# EAGLE design VarmoLed - Rev A1 (EAGLE 7.5.0)
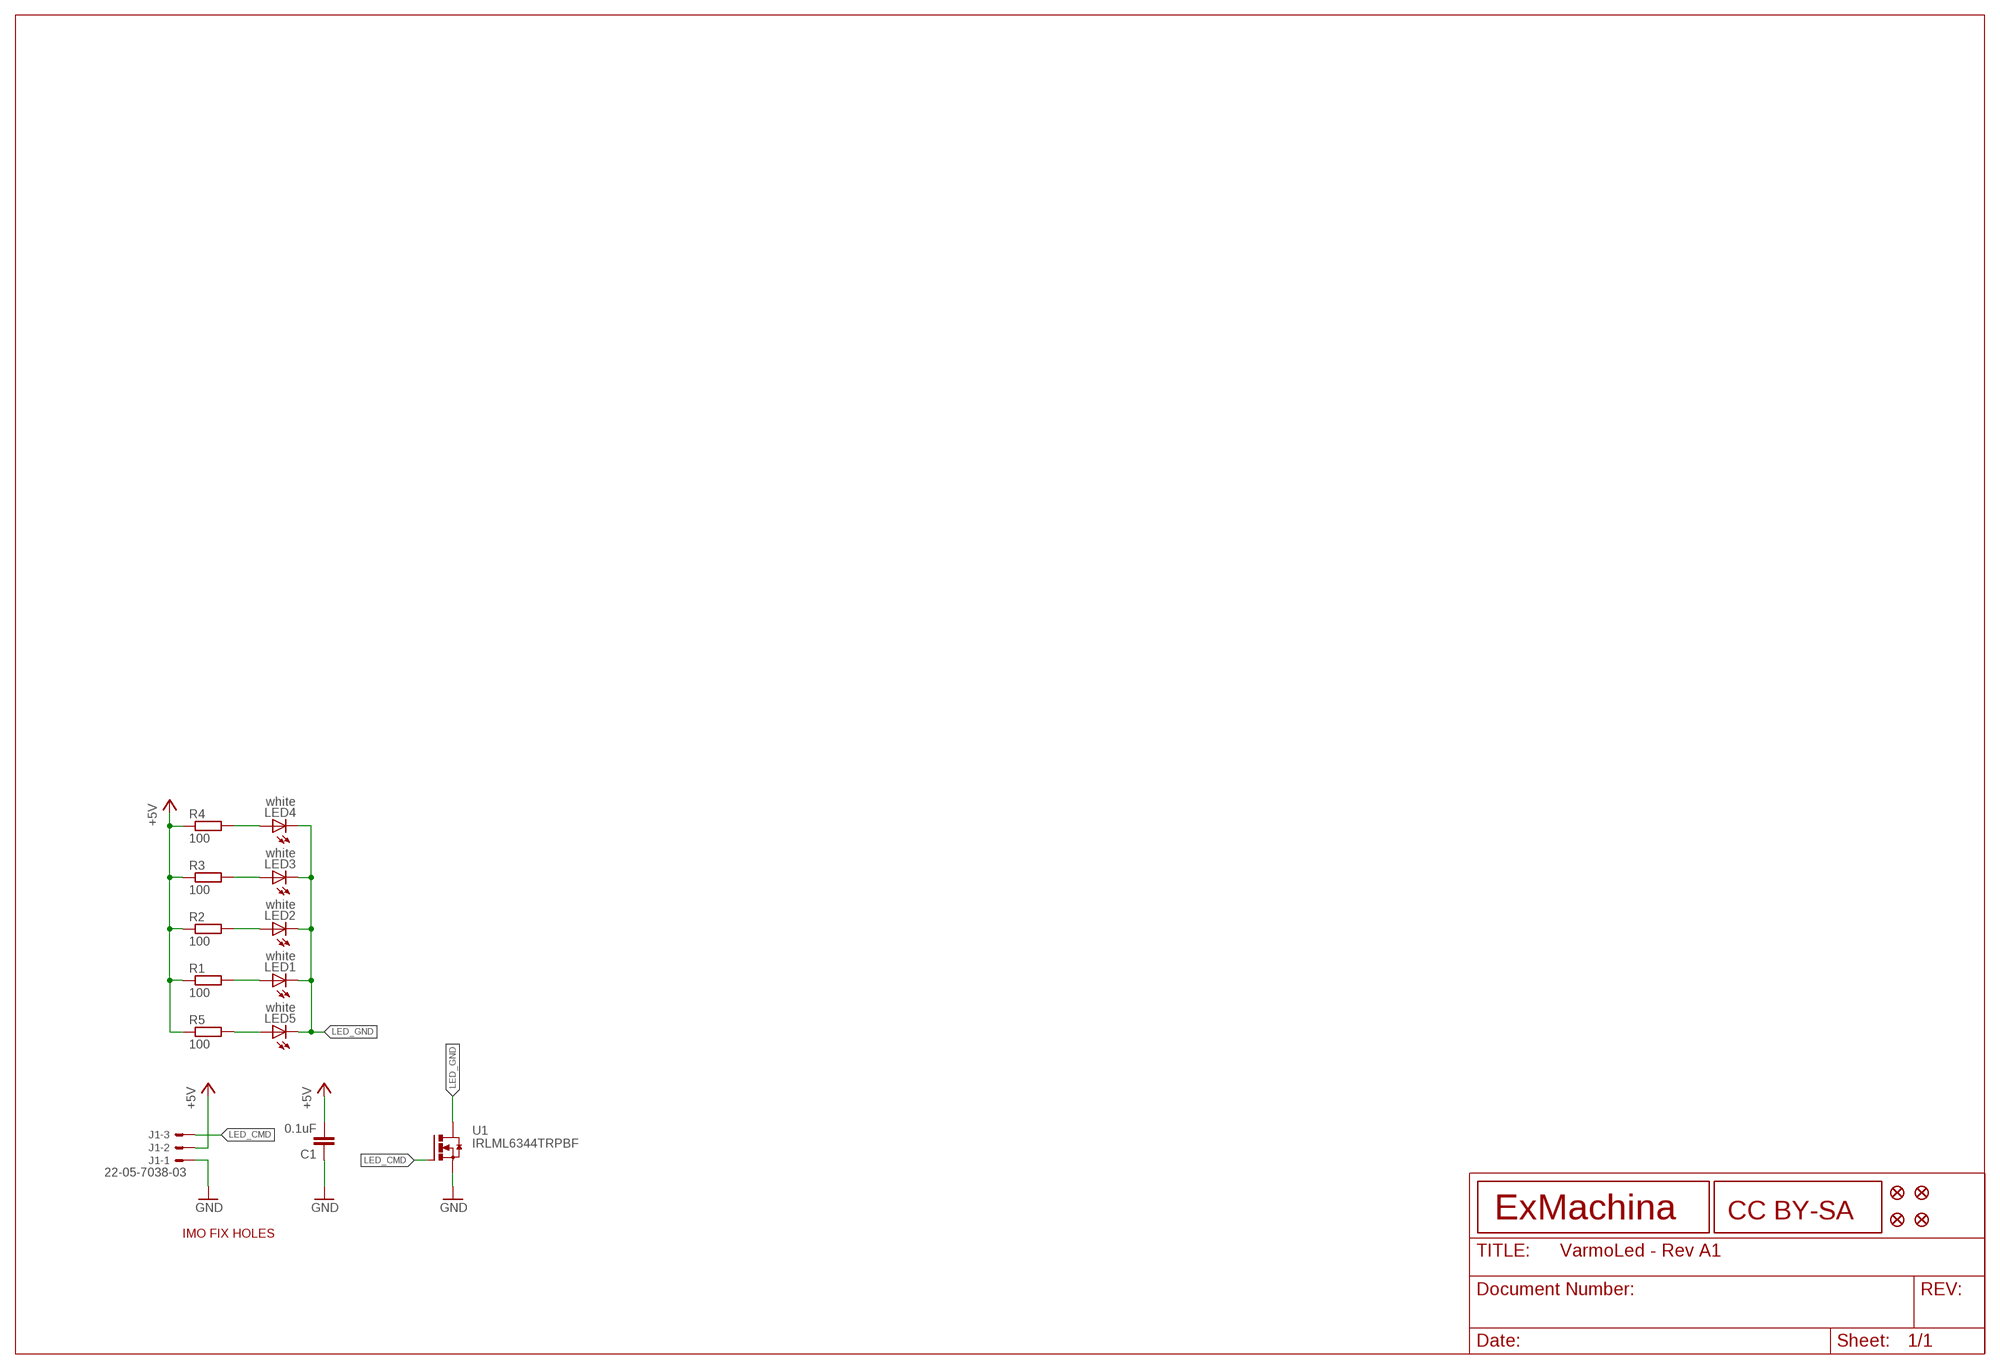
[diagram p0: schematic, sheet 1]

## Parts
C1  0.1uF  C-EUC0603  [C0603]
J1  22-05-7038-03  [7395-03]
JP1  FIDUCIAL1X2  [FIDUCIAL-1X2]
JP2  FIDUCIAL1X2  [FIDUCIAL-1X2]
JP3  FIDUCIAL1X2  [FIDUCIAL-1X2]
JP4  FIDUCIAL1X2  [FIDUCIAL-1X2]
LED1  white  LEDCHIP-LED0603  [CHIP-LED0603]
LED2  white  LEDCHIP-LED0603  [CHIP-LED0603]
LED3  white  LEDCHIP-LED0603  [CHIP-LED0603]
LED4  white  LEDCHIP-LED0603  [CHIP-LED0603]
LED5  white  LEDCHIP-LED0603  [CHIP-LED0603]
R1  100  R-EU_R0603  [R0603]
R2  100  R-EU_R0603  [R0603]
R3  100  R-EU_R0603  [R0603]
R4  100  R-EU_R0603  [R0603]
R5  100  R-EU_R0603  [R0603]
U1  IRLML6344TRPBF  [SOT95P240X112-3N]
U$1  IMO-FIXHOLES  [IMO-FIXHOLES]
U$2  EXMACHINA-LOGO-NAME  [EXM-LOGO-BASELINE]
U$3  CC-BY-SA  [CC-BY-SA]

## Nets
+5V: C1.2 J1.2 R1.1 R2.1 R3.1 R4.1 R5.1
GND: C1.1 J1.1 U1.2(S)
LED_CMD: J1.3 U1.1(G)
LED_GND: LED1.C LED2.C LED3.C LED4.C LED5.C U1.3(D)
N$1: LED1.A R1.2
N$2: LED2.A R2.2
N$3: LED3.A R3.2
N$4: LED4.A R4.2
N$5: LED5.A R5.2

## Library data of the parts
C1 = rcl:C-EU: CAPACITOR, European symbol
J1 = con-molex:22-?-03: CONNECTOR wire to board 2.54 mm (.1 inch) pitch header; OC_FARNELL: 9731610; OC_NEWARK: unknown
JP1-JP4 = SparkFun:FIDUCIAL: Fiducial Alignment Points Various fiducial points for machine vision alignment.
LED1-LED5 = led:LED: LED OSRAM: - CHIPLED LG R971, LG N971, LY N971, LG Q971, LY Q971, LO R971, LY R971 LH N974, LH R974 LS Q976, LO Q976, LY Q976 LO Q996 - Hyper CHIPLED LW Q18S LB Q993, LB Q99A, LB R99A - SideLED LS A670, LO A670, LY A670, LG A670, LP A670 LB A673, LV A673, LT A673, LW A673 LH A674 LY A675 LS A676, LA A676, LO A676, LY A676, LW A676 LS A679, LY A679, LG A679 - Hyper Micro SIDELED® LS Y876, LA Y876, LO Y876, LY Y876 LT Y87S - SmartLED LW L88C, LW L88S LB L89C, LB L89S, LG L890 LS L89K, LO L89K, LY L89K LS L896, LA L896, LO L896, LY L896 - TOPLED LS T670, LO T670, LY T670, LG T670, LP T670 LSG T670, LSP T670, LSY T670, LOP T670, LYG T670 LG T671, LOG T671, LSG T671 LB T673, LV T673, LT T673, LW T673 LH T674 LS T676, LA T676, LO T676, LY T676, LB T676, LH T676, LSB T676, LW T676 LB T67C, LV T67C, LT T67C, LS T67K, LO T67K, LY T67K, LW E67C LS E67B, LA E67B, LO E67B, LY E67B, LB E67C, LV E67C, LT E67C LW T67C LS T679, LY T679, LG T679 LS T770, LO T770, LY T770, LG T770, LP T770 LB T773, LV T773, LT T773, LW T773 LH T774 LS E675, LA E675, LY E675, LS T675 LS T776, LA T776, LO T776, LY T776, LB T776 LHGB T686 LT T68C, LB T68C - Hyper Mini TOPLED® LB M676 - Mini TOPLED Santana® LG M470 LS M47K, LO M47K, LY M47K Source: http://www.osram.convergy.de LUXEON: - LUMILED® LXK2-PW12-R00, LXK2-PW12-S00, LXK2-PW14-U00, LXK2-PW14-V00 LXK2-PM12-R00, LXK2-PM12-S00, LXK2-PM14-U00 LXK2-PE12-Q00, LXK2-PE12-R00, LXK2-PE12-S00, LXK2-PE14-T00, LXK2-PE14-U00 LXK2-PB12-K00, LXK2-PB12-L00, LXK2-PB12-M00, LXK2-PB14-N00, LXK2-PB14-P00, LXK2-PB14-Q00 LXK2-PR12-L00, LXK2-PR12-M00, LXK2-PR14-Q00, LXK2-PR14-R00 LXK2-PD12-Q00, LXK2-PD12-R00, LXK2-PD12-S00 LXK2-PH12-R00, LXK2-PH12-S00 LXK2-PL12-P00, LXK2-PL12-Q00, LXK2-PL12-R00 Source: www.luxeon.com KINGBRIGHT: KA-3528ASYC Source: www.kingbright.com
R1-R5 = rcl:R-EU_: RESISTOR, European symbol
U1 = International_Rectifier_By_element14_Batch_1:IRLML6344TRPBF: Power MOSFET; MPN: IRLML6344TRPBF; OC_FARNELL: 1857299; OC_NEWARK: 25T5501; PACKAGE: SOT-23-3; SUPPLIER: INTERNATIONAL RECTIFIER
U$1 = imo:IMO-FIXHOLES
U$2 = exmachina:EXMACHINA-LOGO
U$3 = cc-by-sa:CC-BY-SA

## Board
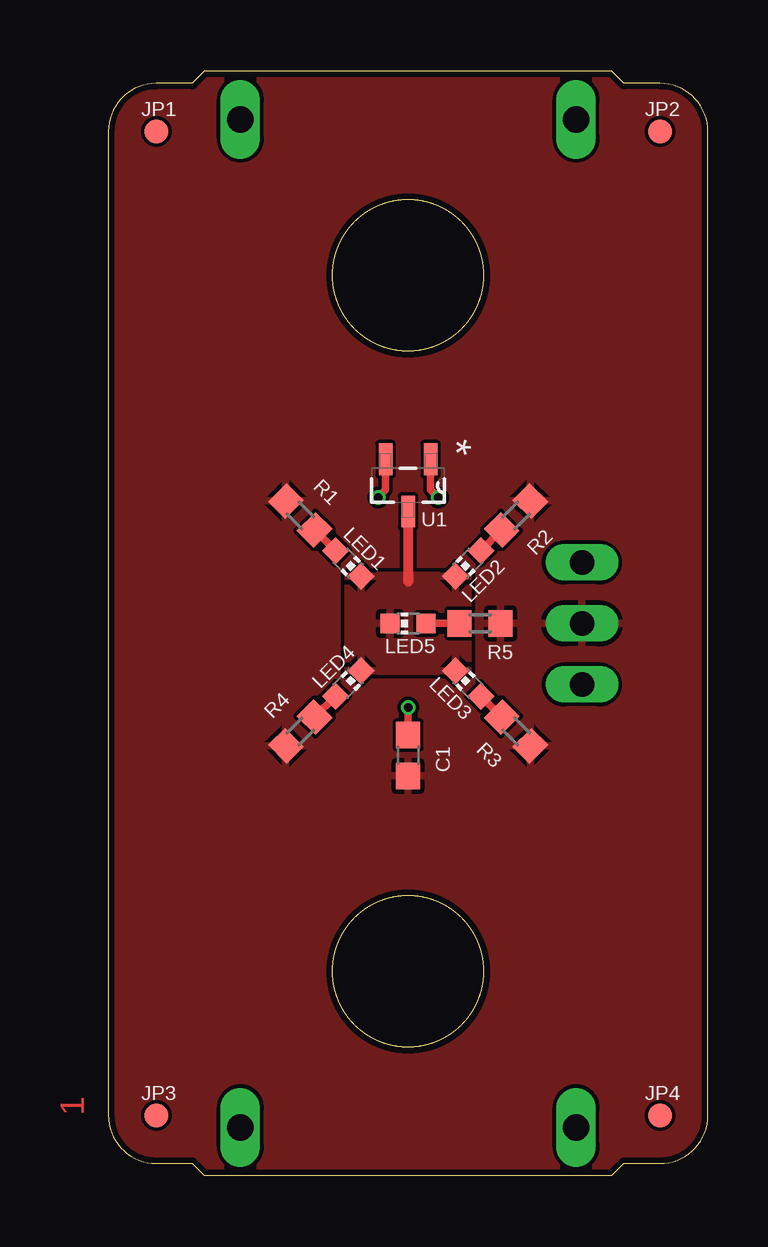
[diagram p1: board, top side]
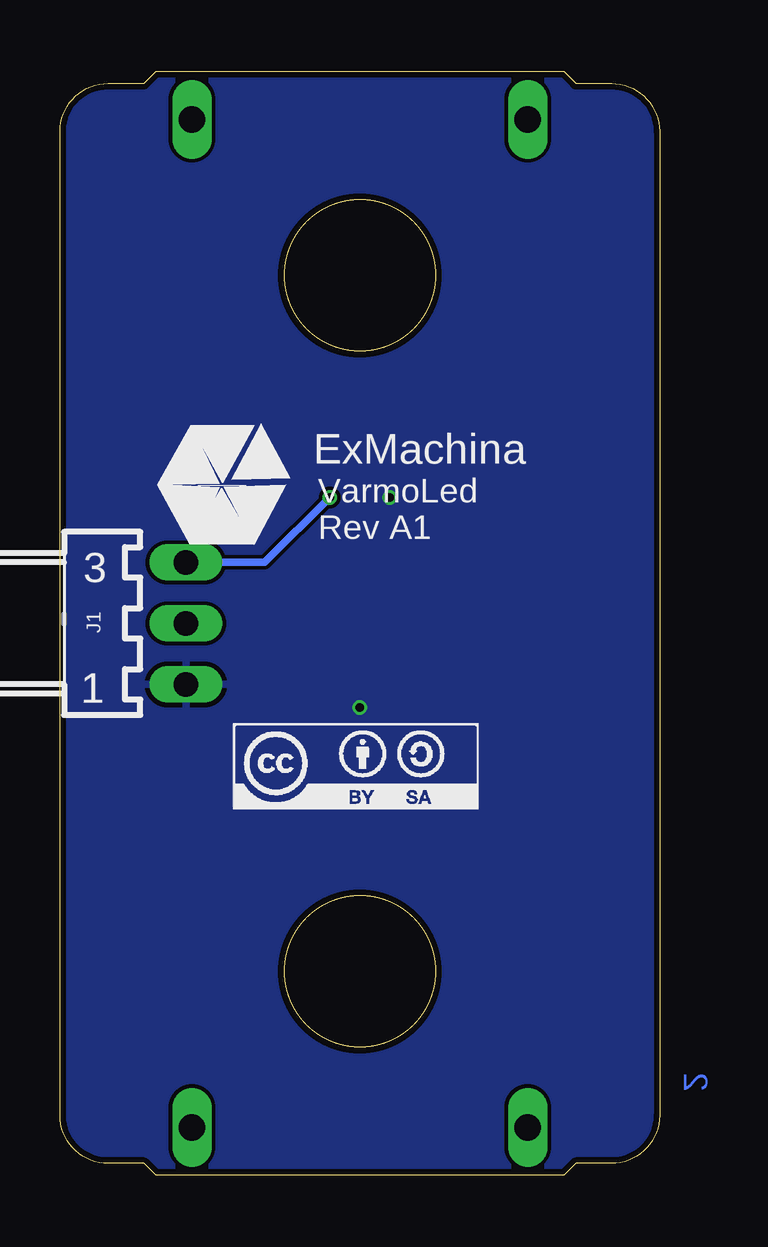
[diagram p2: board, bottom side, seen from below]

Size 25 x 46 mm. Coordinates in mm from the lower left corner, seen from the top.
Outline: 0,43.5 0,2.5 arc90 2,0.5 3.5,0.5 4,0 21,0 21.5,0.5 23,0.5 arc90 25,2.5 25,43.5 arc90 23,45.5 21.5,45.5 21,46 4,46 3.5,45.5 2,45.5 arc90 0,43.5
Copper layers (1*16): Top 0.018mm / dielectric 1.55mm / Bottom 0.018mm
Design rules "eC_2Layer_PClass6_BaseCopperO18_eCDefault": minimum track width 0.15mm, minimum drill 0.35mm, track to track 0.15mm, track to pad 0.15mm, pad to pad 0.15mm, via to via 0.15mm, smd to smd 0mil, copper to edge 0.25mm, drill to drill 0.35mm, minimum pad ring 0.175mm, minimum via ring 0.125mm, stop-mask expansion 0mil, vias tented up to drill 0.45mm, thermal gap 0.2mm

### Footprints (pad centres in the part's own frame; a part is rotated, then mirrored left to right if it is on the bottom)
C0603 = smd 1.1 x 1: 1 -0.85,0; 2 0.85,0
7395-03 = drill 1.016 long: 1 2.54,0; 2 0,0; 3 -2.54,0
FIDUCIAL-1X2 = smd 1 x 1: 1 0,0
CHIP-LED0603 = smd 0.8 x 0.8: A 0,-0.75; C 0,0.75
R0603 = smd 1 x 1.1: 1 -0.85,0; 2 0.85,0
SOT95P240X112-3N = smd 1.321 x 0.559: 1 -1.092,0.94; 2 -1.092,-0.94; 3 1.092,0
IMO-FIXHOLES = drill 1.1 long: P$1 -7,21; P$2 7,21; P$3 7,-21; P$4 -7,-21

### Placement (x,y rotation side)
C1  12.5,17.5 270 top
J1  19.75,23 270 bottom
JP1  2,43.5 0 top
JP2  23,43.5 0 top
JP3  2,2.5 0 top
JP4  23,2.5 0 top
LED1  10,25.5 225 top
LED2  15,25.5 135 top
LED3  15,20.5 45 top
LED4  10,20.5 315 top
LED5  12.5,23 90 top
R1  8,27.5 315 top
R2  17,27.5 225 top
R3  17,18.5 135 top
R4  8,18.5 45 top
R5  15.5,23 180 top
U1  12.5,28.75 270 top
U$1  12.5,23 0 top
U$2  18.25,28.75 0 bottom
U$3  12.5,17.5 0 bottom

### Tracks (layer width: path | path; a pad name or v marks a point on that pad's centre or on a via)
+5V
  pour Top (rank 6): -1,-0.5 26,-0.5 26,46.5 -1,46.5
GND  (via drill 0.35)
  Top 0.305: C1.1 v12.5,19.5 | U1.2 11.56,28.56 v11.25,28.25
  pour Bottom (rank 6): -1,-0.5 26,-0.5 26,46.5 -1,46.5
LED_CMD  (via drill 0.35)
  Top 0.305: U1.1 13.44,28.56 v13.75,28.25
  Bottom 0.305: v13.75,28.25 16.46,25.54 J1.3
LED_GND
  Top 0.406: U1.3 12.5,24.75
  pour Top: 10,24 10,21 15,21 15,25 10,25
N$1
  Top 0.305: R1.2 LED1.A
N$2
  Top 0.305: LED2.A R2.2
N$3
  Top 0.305: R3.2 LED3.A
N$4
  Top 0.305: R4.2 LED4.A
N$5
  Top 0.305: R5.2 LED5.A

### Text on the board
Top: 1
Bottom: 2
bPlace: VarmoLed / Rev A1